# Altium schematic sheet IO.SchDoc
size A
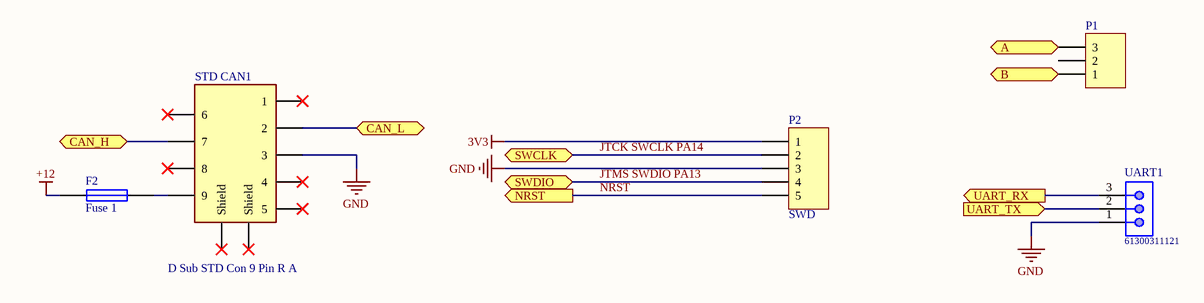
[diagram p0: IO.SchDoc]

## Parts
F2  Fuse 1  [3216[1206]]
P1  (no value)  [B3B-XH-A]
P2  SWD  [B5B-XH-A]
STD_CAN1  D Sub STD Con 9 Pin R A  [D Sub STD Con 9 Pin R A]
UART1  61300311121  [61300311121]

## Ports
A (bidir), B (bidir), CAN_H (bidir), CAN_L (bidir), NRST (out), SWCLK (bidir), SWDIO (bidir), UART_RX (out), UART_TX (in)

## Nets
3V3: P2.1
+12: F2.1
GND: P2.3 STD_CAN1.3 UART1.1
A: P1.3 ; port A
B: P1.1 ; port B
CAN_H: STD_CAN1.7 ; port CAN_H
CAN_L: STD_CAN1.2 ; port CAN_L
JTCK SWCLK PA14: P2.2 ; port SWCLK
JTMS SWDIO PA13: P2.4 ; port SWDIO
NRST: P2.5 ; port NRST
UART_RX: UART1.3 ; port UART_RX
UART_TX: UART1.2 ; port UART_TX
NetF2_2: F2.2 STD_CAN1.9

Not connected (* = marked no-connect by the designer): P1 2; STD_CAN1 1* 4* 5* 6* 8* 10(Shield)* 11(Shield)*

## Library data of the parts
F2 = Fuse 1: Fuse; Published: 8-Jun-2000; LatestRevisionDate: 17-Jul-2002; LatestRevisionNote: Re-released for DXP Platform.; PackageReference: PIN-W2/E2.8; Publisher: Altium Limited; PackageDescription: Thru-Hole; 2 Leads
P1 = Header 3: Header, 3-Pin; LatestRevisionDate: 17-Jul-2002; LatestRevisionNote: Re-released for DXP Platform.; Publisher: Altium Limited
P2 = Header 5: Header, 5-Pin; LatestRevisionDate: 17-Jul-2002; LatestRevisionNote: Re-released for DXP Platform.; Publisher: Altium Limited
UART1 = 61300311121: WR-PHD Pin Header, THT, pitch 2.54mm, Single Row, Vertical, 3pin; Pin Number: 3; Gender: Male; Rated Current: 3A; Working Voltage: 250VAC; Withstanding Voltage: 500VAC; Contact Resistance: 20mOhm; ComponentLink1Description: Manufacturer; ComponentLink1URL: http://www.we-online.de; ComponentLink2Description: Datasheet; ComponentLink2URL: https://katalog.we-online.de/em/datasheet/6130xx11121.pdf; Part Number: 61300311121; Published Date: June 2019; Publisher: Wurth Elektronik; Pitch: 2.54mm; Operating Temperature: -40 to +105degC; Mounting Technology: THT; Packaging: Bag; Row Number: Single; Orientation: Vertical